# EAGLE design circuit-board (EAGLE 9.2.2)
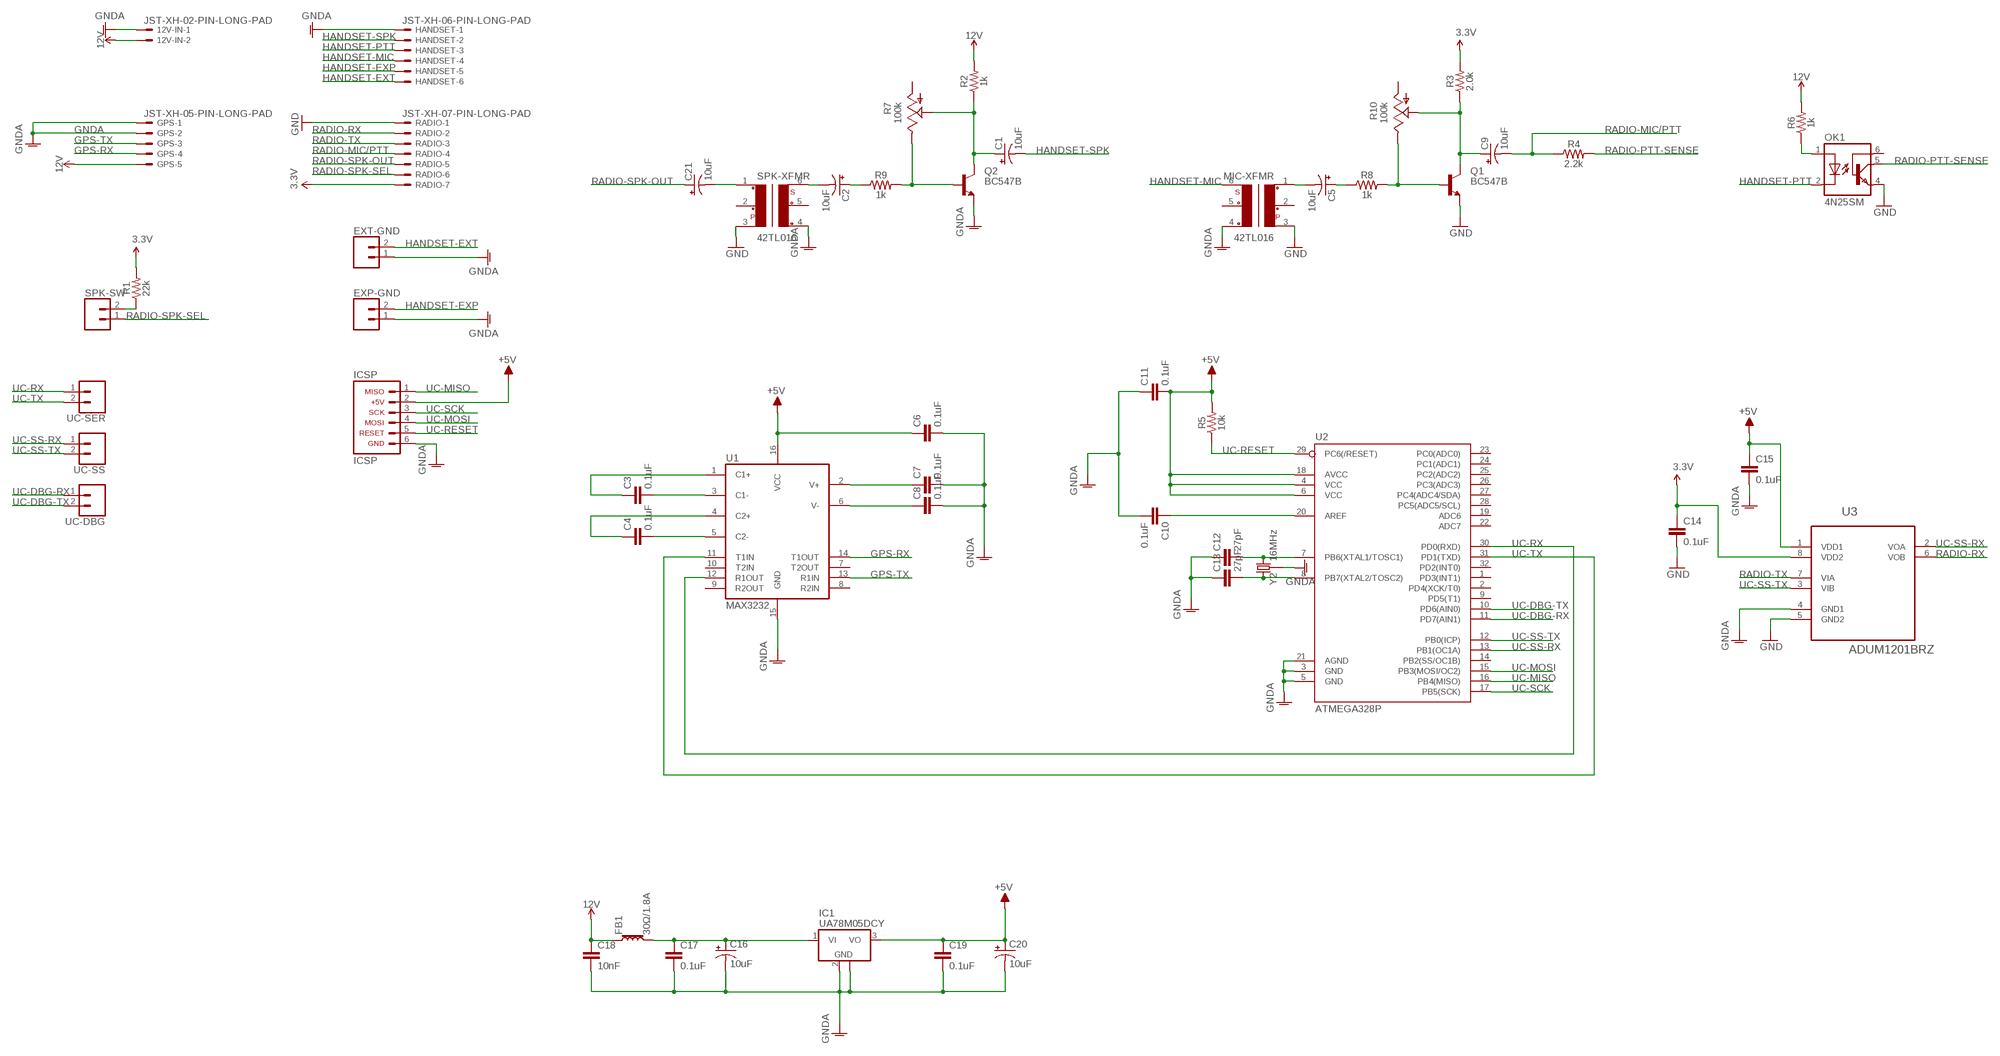
[diagram p0: schematic, sheet 1]

## Parts
12V-IN  JST-XH-02-PIN-LONG-PAD  [JST-XH-02-PACKAGE-LONG-PAD]
C1  10uF  CPOL-USE2.5-5  [E2,5-5]
C2  10uF  CPOL-USE2.5-5  [E2,5-5]
C3  0.1uF  0.1UF-0603-25V-5%  [0603]
C4  0.1uF  0.1UF-0603-25V-5%  [0603]
C5  10uF  CPOL-USE2.5-5  [E2,5-5]
C6  0.1uF  0.1UF-0603-25V-5%  [0603]
C7  0.1uF  0.1UF-0603-25V-5%  [0603]
C8  0.1uF  0.1UF-0603-25V-5%  [0603]
C9  10uF  CPOL-USE2.5-5  [E2,5-5]
C10  0.1uF  0.1UF-0603-25V-5%  [0603]
C11  0.1uF  0.1UF-0603-25V-5%  [0603]
C12  27pF  27PF-0603-50V-5%  [0603]
C13  27pF  27PF-0603-50V-5%  [0603]
C14  0.1uF  0.1UF-0603-25V-5%  [0603]
C15  0.1uF  0.1UF-0603-25V-5%  [0603]
C16  10uF  CPOL-USE2.5-5  [E2,5-5]
C17  0.1uF  0.1UF-0603-25V-5%  [0603]
C18  10nF  10NF-0603-50V-10%  [0603]
C19  0.1uF  0.1UF-0603-25V-5%  [0603]
C20  10uF  CPOL-USE2.5-5  [E2,5-5]
C21  10uF  CPOL-USE2.5-5  [E2,5-5]
EXP-GND  CONN_02  [1X02]
EXT-GND  CONN_02  [1X02]
FB1  30Ω/1.8A  FERRITE_BEAD-0603  [0603]
GPS  JST-XH-05-PIN-LONG-PAD  [JST-XH-05-PACKAGE-LONG-PAD]
HANDSET  JST-XH-06-PIN-LONG-PAD  [JST-XH-06-PACKAGE-LONG-PAD]
IC1  UA78M05DCY  [SOT223]
ICSP  ARDUINO_CONN-ICSP  [CONN-2X03]
MIC-XFMR  42TL016  [42TL]
OK1  4N25SM  [DIL6-SMD]
Q1  BC547B  [TO92]
Q2  BC547B  [TO92]
R1  22k  22KOHM-0603-1/10W-1%  [0603]
R2  1k  1KOHM-0603-1/10W-1%  [0603]
R3  2.0k  2.0KOHM-0603-1/10W-5%  [0603]
R4  2.2k  2.2KOHM-0603-1/10W-1%  [0603]
R5  10k  10KOHM-0603-1/10W-1%  [0603]
R6  1k  1KOHM-0603-1/10W-1%  [0603]
R7  100k  TRIM_US-S64W  [S64W]
R8  1k  1KOHM-0603-1/10W-1%  [0603]
R9  1k  1KOHM-0603-1/10W-1%  [0603]
R10  100k  TRIM_US-S64W  [S64W]
RADIO  JST-XH-07-PIN-LONG-PAD  [JST-XH-07-PACKAGE-LONG-PAD]
SPK-SW  CONN_02  [1X02]
SPK-XFMR  42TL016  [42TL]
U1  MAX3232  MAX2323SOIC16  [SO16]
U2  ATMEGA328P  ATMEGA328P_TQFP  [TQFP32-08]
U3  ADUM1201BRZ  [SOIC127P600X175-8N]
UC-DBG  CONN_02  [1X02]
UC-SER  CONN_02  [1X02]
UC-SS  CONN_02  [1X02]
Y2  16MHz  CRYSTAL-GROUNDEDSMD-3.2X2.5  [CRYSTAL-SMD-3.2X2.5MM]

## Nets
3.3V: C14.1 R1.2 R3.2 RADIO.7 U3.8(VDD2)
12V: 12V-IN.2 C18.1 FB1.1 GPS.5 R2.2 R6.2
+5V: C6.1 C11.2 C15.1 C19.1 C20.+ IC1.3(VO) ICSP.2 R5.2 U1.16(VCC) U2.4(VCC) U2.6(VCC) U2.18(AVCC) U3.1(VDD1)
GND: C14.2 MIC-XFMR.3 OK1.4(EMI) Q1.1(E) RADIO.1 SPK-XFMR.3 U3.5(GND2)
GNDA: 12V-IN.1 C6.2 C7.2 C8.2 C10.2 C11.1 C12.1 C13.1 C15.2 C16.- C17.2 C18.2 C19.2 C20.- EXP-GND.1 EXT-GND.1 GPS.1 GPS.2 HANDSET.1 IC1.2(GND) IC1.4(GND) ICSP.6 MIC-XFMR.4 Q2.1(E) SPK-XFMR.4 U1.15(GND) U2.3(GND) U2.5(GND) U2.21(AGND) U3.4(GND1) Y2.2 Y2.4
GPS-RX: GPS.4 U1.14(T1OUT)
GPS-TX: GPS.3 U1.13(R1IN)
HANDSET-EXP: EXP-GND.2 HANDSET.5
HANDSET-EXT: EXT-GND.2 HANDSET.6
HANDSET-MIC: HANDSET.4 MIC-XFMR.6
HANDSET-PTT: HANDSET.3 OK1.2(C)
HANDSET-SPK: C1.- HANDSET.2
N$1: C16.+ C17.1 FB1.2 IC1.1(VI)
N$2: C2.- SPK-XFMR.6
N$3: C9.+ Q1.3(C) R3.1 R10.S
N$4: Q1.2(B) R8.2 R10.E
N$5: Q2.2(B) R7.E R9.2
N$6: C21.- SPK-XFMR.1
N$7: C5.- MIC-XFMR.1
N$8: C5.+ R8.1
N$9: OK1.1(A) R6.1
N$10: C2.+ R9.1
N$12: R1.1 SPK-SW.2
N$15: C3.2 U1.3(C1-)
N$16: C3.1 U1.1(C1+)
N$17: C4.2 U1.5(C2-)
N$18: C4.1 U1.4(C2+)
N$20: C7.1 U1.2(V+)
N$21: C8.1 U1.6(V-)
N$22: C10.1 U2.20(AREF)
N$23: C12.2 U2.7(PB6(XTAL1/TOSC1)) Y2.3
N$24: C13.2 U2.8(PB7(XTAL2/TOSC2)) Y2.1
RADIO-MIC/PTT: C9.- R4.1 RADIO.4
RADIO-PTT-SENSE: OK1.5(COL) R4.2
RADIO-RX: RADIO.2 U3.6(VOB)
RADIO-SPK-OUT: C21.+ RADIO.5
RADIO-SPK-SEL: RADIO.6 SPK-SW.1
RADIO-TX: RADIO.3 U3.7(VIA)
SPKAMP: C1.+ Q2.3(C) R2.1 R7.S
UC-DBG-RX: U2.11(PD7(AIN1)) UC-DBG.1
UC-DBG-TX: U2.10(PD6(AIN0)) UC-DBG.2
UC-MISO: ICSP.1 U2.16(PB4(MISO))
UC-MOSI: ICSP.4 U2.15(PB3(MOSI/OC2))
UC-RESET: ICSP.5 R5.1 U2.29(PC6(/RESET))
UC-RX: U1.12(R1OUT) U2.30(PD0(RXD)) UC-SER.1
UC-SCK: ICSP.3 U2.17(PB5(SCK))
UC-SS-RX: U2.13(PB1(OC1A)) U3.2(VOA) UC-SS.1
UC-SS-TX: U2.12(PB0(ICP)) U3.3(VIB) UC-SS.2
UC-TX: U1.11(T1IN) U2.31(PD1(TXD)) UC-SER.2
Unconnected: MIC-XFMR.2 MIC-XFMR.5 OK1.6(BAS) R7.A R10.A SPK-XFMR.2 SPK-XFMR.5 U1.7(T2OUT) U1.8(R2IN) U1.9(R2OUT) U1.10(T2IN) U2.1(PD3(INT1)) U2.2(PD4(XCK/T0)) U2.9(PD5(T1)) U2.14(PB2(SS/OC1B)) U2.19(ADC6) U2.22(ADC7) U2.23(PC0(ADC0)) U2.24(PC1(ADC1)) U2.25(PC2(ADC2)) U2.26(PC3(ADC3)) U2.27(PC4(ADC4/SDA)) U2.28(PC5(ADC5/SCL)) U2.32(PD2(INT0))

## Library data of the parts
12V-IN = Rembrandt Electronics - JST XH Connectors v1-0:JST-XH-02-PIN: JST XH Connector 2 Pin Wire to board connector. Pitch: 2,54 mm, (0.100") Number of pins: 2 Created by Rembrandt Electronics www.rembrandtelectronics.com
C1 C2 C5 C9 C16 C20 C21 = adafruit:CPOL-US: POLARIZED CAPACITOR, American symbol
C3 C4 C6-C8 C10 C11 C14 C15 C17 C19 = SparkFun-Capacitors:0.1UF: 0.1µF ceramic capacitors A capacitor is a passive two-terminal electrical component used to store electrical energy temporarily in an electric field.; PROD_ID: CAP-08604
C12 C13 = SparkFun-Capacitors:27PF: 27pF ceramic capacitors A capacitor is a passive two-terminal electrical component used to store electrical energy temporarily in an electric field.; PROD_ID: CAP-09989
C18 = SparkFun-Capacitors:10NF: 0.01uF/10nF/10,000pF ceramic capacitors A capacitor is a passive two-terminal electrical component used to store electrical energy temporarily in an electric field. CAP-09321; PROD_ID: CAP-00867
EXP-GND EXT-GND SPK-SW UC-DBG UC-SER UC-SS = SparkFun-Connectors:CONN_02: Multi connection point. Often used as Generic Header-pin footprint for 0.1 inch spaced/style header connections On any of the 0.1 inch spaced packages, you can populate with these: Break Away Headers - Straight <https://www.sparkfun.com/products/116> (PRT-00116) Break Away Male Headers - Right Angle <https://www.sparkfun.com/products/553> (PRT-00553) Female Headers <https://www.sparkfun.com/products/115> (PRT-00115) Break Away Headers - Machine Pin <https://www.sparkfun.com/products/117> (PRT-00117) Break Away Female Headers - Swiss Machine Pin <https://www.sparkfun.com/products/743> (PRT-00743) For SCREWTERMINALS and SPRING TERMINALS visit here: Screw Terimnals on SparkFun.com <https://www.sparkfun.com/search/results?term=Screw+Terminals> (5mm/3.5mm/2.54mm spacing) This device is also useful as a general connection point to wire up your design to another part of your project. Our various solder wires solder well into these plated through hole pads. Hook-Up Wire - Assortment (Stranded, 22 AWG) <https://www.sparkfun.com/products/11375> (PRT-11375) Hook-Up Wire - Assortment (Solid Core, 22 AWG) <https://www.sparkfun.com/products/11367> (PRT-11367) View the entire wire category on our website here <https://www.sparkfun.com/categories/141> Special notes: Molex polarized connector foot print use with: PRT-08233 with associated crimp pins and housings. 2.54_SCREWTERM for use with PRT-10571. 3.5mm Screw Terminal footprints for PRT-08084 5mm Screw Terminal footprints for use with PRT-08432
FB1 = SparkFun-Coils:FERRITE_BEAD: Ferrite Bead (blocks, cores, rings, chokes, etc.) Inductor with layers of ferrite used to suppress high frequencies. Often used to isolate high frequency noise. SparkFun Products: IOIO-OTG - V2.2 <https://www.sparkfun.com/products/13613> SparkFun SAMD21 Mini Breakout <https://www.sparkfun.com/products/13664> SparkFun 6 Degrees of Freedom Breakout - LSM6DS3 <https://www.sparkfun.com/products/13339> SparkFun SAMD21 Dev Breakout <https://www.sparkfun.com/products/13672>; PROD_ID: NDUC-07859
GPS = Rembrandt Electronics - JST XH Connectors v1-0:JST-XH-05-PIN: JST XH Connector 2 Pin Wire to board connector. Pitch: 2,54 mm, (0.100") Number of pins: 5 Created by Rembrandt Electronics www.rembrandtelectronics.com
HANDSET = Rembrandt Electronics - JST XH Connectors v1-0:JST-XH-06-PIN: JST XH Connector 2 Pin Wire to board connector. Pitch: 2,54 mm, (0.100") Number of pins: 6 Created by Rembrandt Electronics www.rembrandtelectronics.com
IC1 = linear:UA78M*: POSITIVE-VOLTAGE REGULATORS Source: http://focus.ti.com/lit/ds/symlink/ua78m33.pdf
ICSP = arduino_jw:ARDUINO_CONN-ICSP: Arduino ICSP I/O Header This is the ICSP I/O header on the Arduino Uno R3. This connector is labeled with the following pin assignments: MISO +5V SCK MOSI RESET GND NOTE: Be sure you install this connector with the correct orientation on your PCB layout. Pin 1 has a square pad to assist with orientation.
MIC-XFMR SPK-XFMR = trafo-xicon:42T?*: Xicon Micro-Mini EI-12 Audio Transformers 42TL/42TC/42TM Series Source: http://www.mouser.com//catalog/specsheets/164201.pdf http://www.mouser.com/catalog/specsheets/114225.pdf http://www.mouser.com/catalog/specsheets/164267.pdf; OC_FARNELL: unknown; OC_NEWARK: unknown
OK1 = optocoupler:4N*?M: General Purpose 6-Pin Phototransistor Optocouplers Source: http://www.fairchildsemi.com/ds/4N/4N35-M.pdf; MF: FAIRCHILD SEMICONDUCTOR; MPN: 4N25SM; OC_FARNELL: 1021152; OC_NEWARK: 34C2020
Q1 Q2 = transistor-npn:BC547*: NPN Transistor
R1 = SparkFun-Resistors:22KOHM: 22kΩ resistor A resistor is a passive two-terminal electrical component that implements electrical resistance as a circuit element. Resistors act to reduce current flow, and, at the same time, act to lower voltage levels within circuits. - Wikipedia; PROD_ID: RES-07853
R2 R6 R8 R9 = SparkFun-Resistors:1KOHM: 1kΩ resistor A resistor is a passive two-terminal electrical component that implements electrical resistance as a circuit element. Resistors act to reduce current flow, and, at the same time, act to lower voltage levels within circuits. - Wikipedia; PROD_ID: RES-07856
R3 = SparkFun-Resistors:2.0KOHM: 2kΩ resistor A resistor is a passive two-terminal electrical component that implements electrical resistance as a circuit element. Resistors act to reduce current flow, and, at the same time, act to lower voltage levels within circuits. - Wikipedia; PROD_ID: RES-08296
R4 = SparkFun-Resistors:2.2KOHM: 2.2kΩ resistor A resistor is a passive two-terminal electrical component that implements electrical resistance as a circuit element. Resistors act to reduce current flow, and, at the same time, act to lower voltage levels within circuits. - Wikipedia; PROD_ID: RES-08272
R5 = SparkFun-Resistors:10KOHM: 10kΩ resistor A resistor is a passive two-terminal electrical component that implements electrical resistance as a circuit element. Resistors act to reduce current flow, and, at the same time, act to lower voltage levels within circuits. - Wikipedia; PROD_ID: RES-00824
R7 R10 = pot:TRIM_US-: POTENTIOMETER
RADIO = Rembrandt Electronics - JST XH Connectors v1-0:JST-XH-07-PIN: JST XH Connector 2 Pin Wire to board connector. Pitch: 2,54 mm, (0.100") Number of pins: 7 Created by Rembrandt Electronics www.rembrandtelectronics.com
U1 = SparkFun-IC-Comms:MAX2323: RS232 Transceiver This part covers 232 drivers that are compatible with the MAX3232. Sipex SP3232EB Datasheet <http://cdn.sparkfun.com/datasheets/Components/General%20IC/SP3232EBCA-L.pdf> SparkFun Products SOIC component <https://www.sparkfun.com/products/589> (COM-00589 / IC-08171) Retired DIP component (COM-00316 / IC-08446) SparkFun Transceiver Breakout - MAX3232 <https://www.sparkfun.com/products/11189> (BOB-11189) SparkFun XBee Explorer Serial <https://www.sparkfun.com/products/13225> (WRL-13225); PROD_ID: IC-08171
U2 = SparkFun-IC-Microcontroller:ATMEGA328P_TQFP: Popular 328P in QFP Storefront component: ATmega328 - TQFP <https://www.sparkfun.com/products/13448> (COM-13448) Datasheet <http://www.sparkfun.com/datasheets/Components/SMD/ATMega328.pdf> SparkFun Products SparkFun RedBoard - Programmed with Arduino <https://www.sparkfun.com/products/12757> (DEV-12757) Arduino Pro Mini 328 - 5V/16MHz <https://www.sparkfun.com/products/11113> (DEV-11113) Arduino Pro Mini 328 - 3.3V/8MHz <https://www.sparkfun.com/products/11114> (DEV-11114) SparkFun OpenLog <https://www.sparkfun.com/products/13712> (DEV-13712) SparkFun MicroView - OLED Arduino Module <https://www.sparkfun.com/products/12923> (DEV-12923) SparkFun Digital Sandbox <https://www.sparkfun.com/products/12651> (DEV-12651) SparkFun PicoBoard <https://www.sparkfun.com/products/11888> (WIG-11888) Arduino Fio <https://www.sparkfun.com/products/10116> (DEV-10116) LilyPad Arduino 328 Main Board <https://www.sparkfun.com/products/13342> (DEV-13342) SparkFun RedStick <https://www.sparkfun.com/products/13741> (DEV-13741) LilyPad MP3 <https://www.sparkfun.com/products/11013> (DEV-11013) LilyPad Arduino SimpleSnap <https://www.sparkfun.com/products/10941> (DEV-10941) SparkFun Stepoko <https://www.sparkfun.com/products/13899> (ROB-13899) SparkFun Geiger Counter <https://www.sparkfun.com/products/11345> (SEN-11345) SparkFun EL Sequencer <https://www.sparkfun.com/products/12781> (COM-12781) Arduino Pro 328 - 5V/16MHz <https://www.sparkfun.com/products/10915> (DEV-10915) CryptoCape <https://www.sparkfun.com/products/12773> (DEV-12773) SparkFun IR Thermometer Evaluation Board - MLX90614 <https://www.sparkfun.com/products/10740> (SEN-10740) SparkFun RedBot Mainboard <https://www.sparkfun.com/products/12097> (ROB-12097) Arduino Pro 328 - 3.3V/8MHz <https://www.sparkfun.com/products/10914> (DEV-10914) SparkFun Block for Intel® Edison - Arduino <https://www.sparkfun.com/products/13036> (DEV-13036) SparkFun Simon Says - Surface Mount Soldering Kit <https://www.sparkfun.com/products/10935> (KIT-10935) SparkFun 7-Segment Serial Display - Red <https://www.sparkfun.com/products/11441> (COM-11441) SparkFun 7-Segment Serial Display - White <https://www.sparkfun.com/products/11629> (COM-11629) SparkFun 7-Segment Serial Display - Yellow <https://www.sparkfun.com/products/11443> (COM-11443) SparkFun 7-Segment Serial Display - Kelly Green <https://www.sparkfun.com/products/11440> (COM-11440) SparkFun 7-Segment Serial Display - Blue <https://www.sparkfun.com/products/11442> (COM-11442) SparkFun OpenSegment Serial Display - 20mm (Blue) <https://www.sparkfun.com/products/11647> (COM-11647) SparkFun OpenSegment Serial Display - 20mm (Green) <https://www.sparkfun.com/products/11646> (COM-11646) SparkFun OpenSegment Serial Display - 20mm (White) <https://www.sparkfun.com/products/11648> (COM-11648) SparkFun OpenSegment Serial Display - 20mm (Red) <https://www.sparkfun.com/products/11644> (COM-11644) SparkFun OpenSegment Serial Display - 20mm (Yellow) <https://www.sparkfun.com/products/11645> (COM-11645) SparkFun OpenSegment Shield <https://www.sparkfun.com/products/13190> (DEV-13190); PROD_ID: IC-09069; VALUE: ATMEGA328P_TQFP
U3 = Analog Devices_By_element14_Batch_1:ADUM1201BRZ: Dual-Channel Digital Isolators; MPN: ADUM1201BRZ; OC_FARNELL: 1078201; OC_NEWARK: 19M8748; PACKAGE: SOIC-8; SUPPLIER: Analog Devices
Y2 = SparkFun-Clocks:CRYSTAL-GROUNDED: Crystals w/ Ground Pin (Generic) These are passive quartz crystals, which can be used as a clock source for a microcontroller. Crystal's are usually two-terminal devices. A third terminal may be optionally connected to ground, as recommended by the manufaturer.

## Board
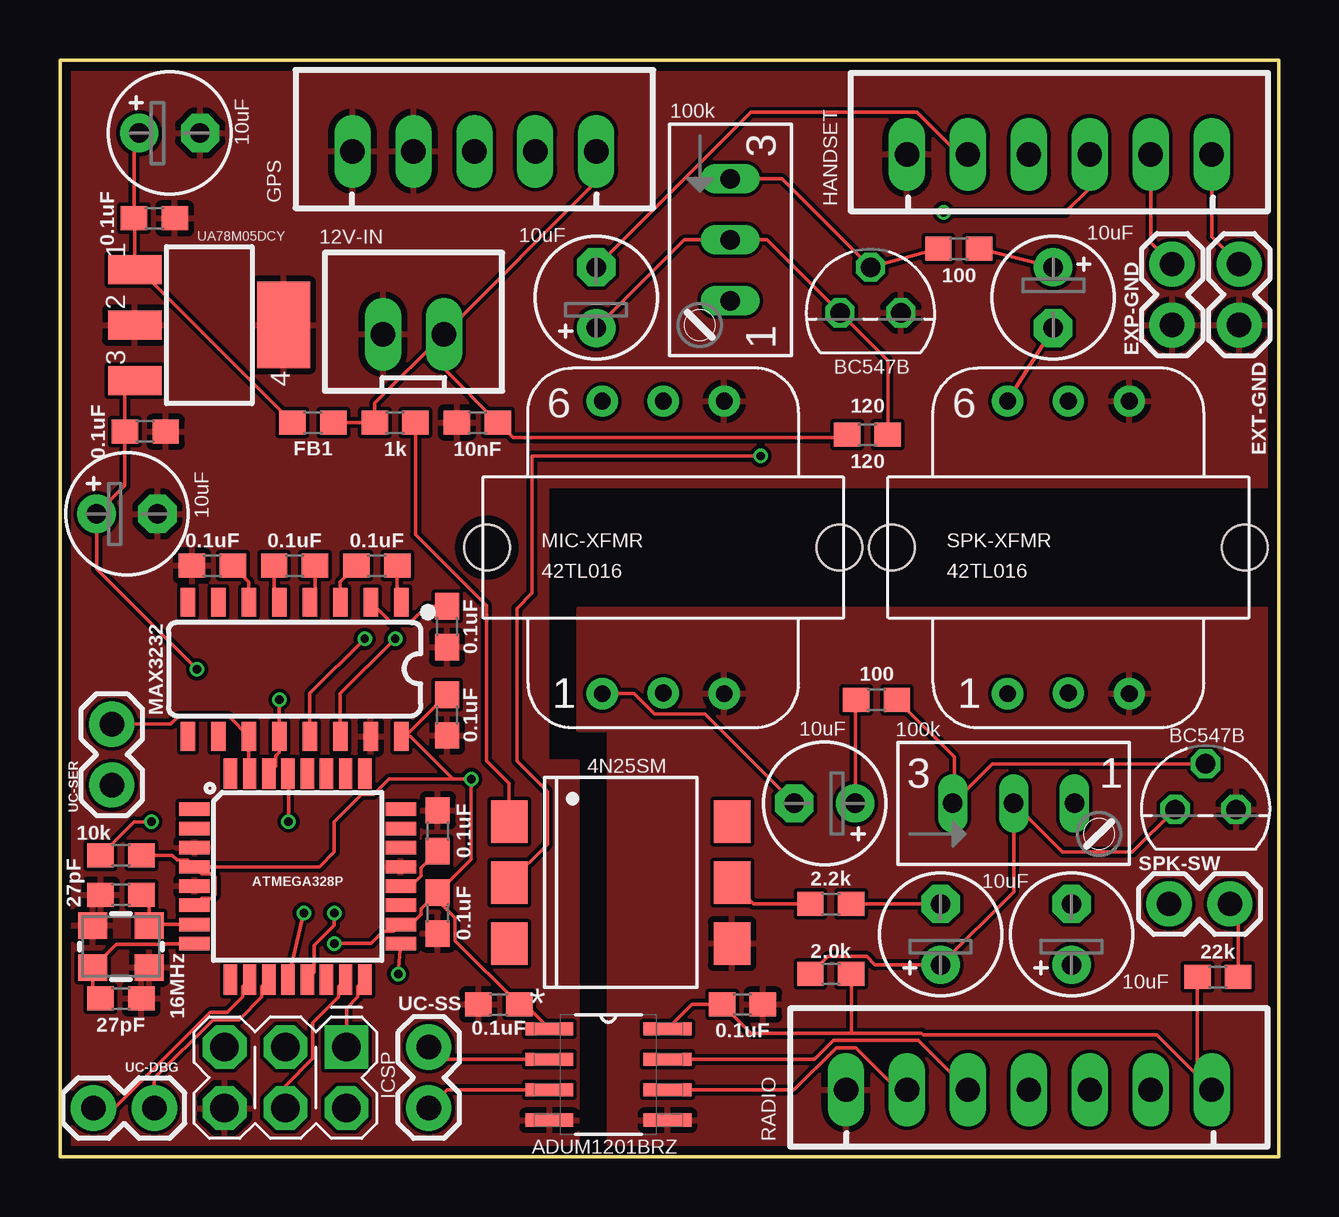
[diagram p1: board, top side]
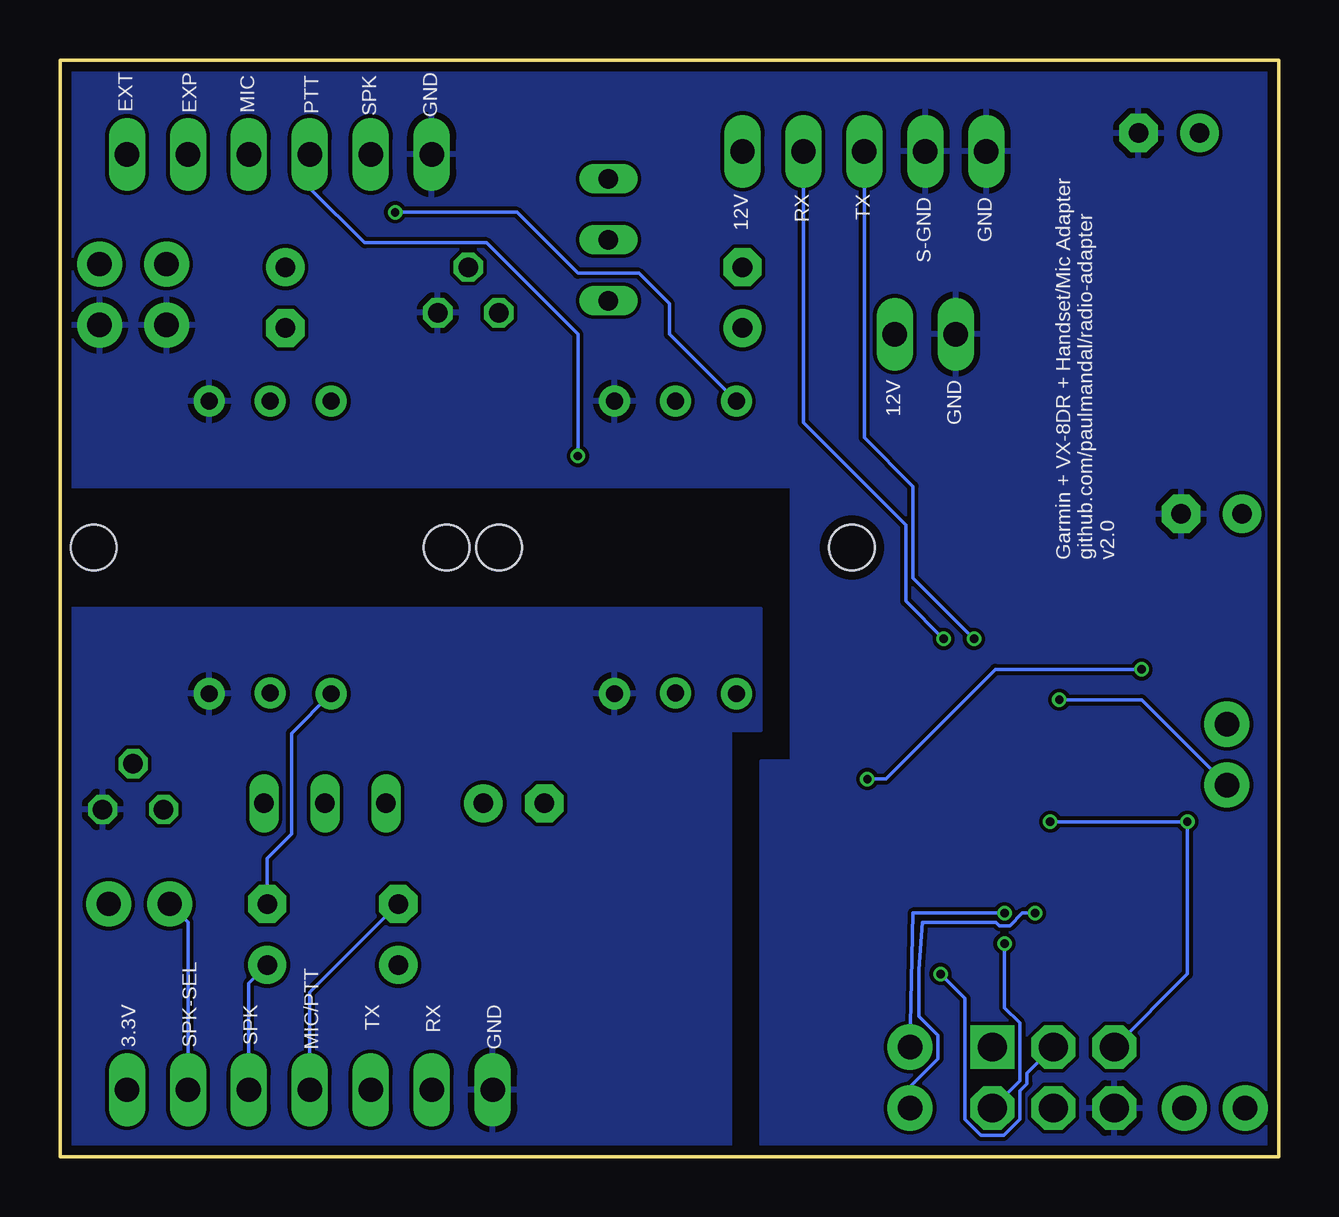
[diagram p2: board, bottom side, seen from below]

Size 50.8 x 45.72 mm. Coordinates in mm from the lower left corner, seen from the top.
Outline: 0,0 50.8,0 50.8,45.72 0,45.72 0,0
Copper layers (1*16): Top 0.035559375mm / dielectric 1.6mm / Bottom 0.035559375mm
Design rules "oshpark-2layer *": minimum track width 6mil, minimum drill 10mil, track to track 6mil, track to pad 6mil, pad to pad 6mil, via to via 6mil, smd to smd 6mil, copper to edge 15mil, drill to drill 6mil, minimum pad ring 5mil, minimum via ring 5mil, stop-mask expansion 2.5mil, vias tented up to drill 20mil, thermal gap 10mil

### Footprints (pad centres in the part's own frame; a part is rotated, then mirrored left to right if it is on the bottom)
JST-XH-02-PACKAGE-LONG-PAD = drill 1.016 long: 1 -1.27,0; 2 1.27,0
E2,5-5 = drill 0.813 pad 1.6: + -1.27,0 | drill 0.813 pad 1.6 octagon: - 1.27,0
0603 = smd 1.1 x 1: 1 -0.85,0; 2 0.85,0
1X02 = drill 1.016 pad 1.88: 1 0,0; 2 2.54,0
JST-XH-05-PACKAGE-LONG-PAD = drill 1.016 long: 1 -5.08,0; 2 -2.54,0; 3 0,0; 4 2.54,0; 5 5.08,0
JST-XH-06-PACKAGE-LONG-PAD = drill 1.016 long: 1 -6.35,0; 2 -3.81,0; 3 -1.27,0; 4 1.27,0; 5 3.81,0; 6 6.35,0
SOT223 = smd 1.219 x 2.235: 1 -2.311,-3.099; 2 0,-3.099; 3 2.311,-3.099 | smd 3.6 x 2.2: 4 0,3.099
CONN-2X03 = drill 1.2 pad 1.829 square: 1 0,0 | drill 1.2 pad 1.829 octagon: 2 2.54,0; 3 0,-2.54; 4 2.54,-2.54; 5 0,-5.08; 6 2.54,-5.08
42TL = drill 0.7 pad 1.3: 1 -2.54,-6.096; 2 0,-6.068; 3 2.54,-6.096; 4 2.54,6.096; 5 0,6.096; 6 -2.54,6.096 | hole 1.9: -7.353,0; 7.353,0
DIL6-SMD = smd 1.78 x 1.52: 1 -2.54,-4.645; 2 0,-4.645; 3 2.54,-4.645; 4 2.54,4.645; 5 0,4.645; 6 -2.54,4.645
TO92 = drill 0.813 octagon: 1 1.27,0; 2 0,1.905; 3 -1.27,0
S64W = drill 0.813 long: A 2.54,1.27; E -2.54,1.27; S 0,1.27
JST-XH-07-PACKAGE-LONG-PAD = drill 1.016 long: 1 -7.62,0; 2 -5.08,0; 3 -2.54,0; 4 0,0; 5 2.54,0; 6 5.08,0; 7 7.62,0
SO16 = smd 0.6 x 1.2: 1 -4.445,-2.8; 2 -3.175,-2.8; 3 -1.905,-2.8; 4 -0.635,-2.8; 5 0.635,-2.8; 6 1.905,-2.8; 7 3.175,-2.8; 8 4.445,-2.8; 9 4.445,2.8; 10 3.175,2.8; 11 1.905,2.8; 12 0.635,2.8; 13 -0.635,2.8; 14 -1.905,2.8; 15 -3.175,2.8; 16 -4.445,2.8
TQFP32-08 = smd 1.27 x 0.559: 1 -4.293,2.8; 2 -4.293,2; 3 -4.293,1.2; 4 -4.293,0.4; 5 -4.293,-0.4; 6 -4.293,-1.2; 7 -4.293,-2; 8 -4.293,-2.8; 17 4.293,-2.8; 18 4.293,-2; 19 4.293,-1.2; 20 4.293,-0.4; 21 4.293,0.4; 22 4.293,1.2; 23 4.293,2; 24 4.293,2.8 | smd 0.559 x 1.27: 9 -2.8,-4.293; 10 -2,-4.293; 11 -1.2,-4.293; 12 -0.4,-4.293; 13 0.4,-4.293; 14 1.2,-4.293; 15 2,-4.293; 16 2.8,-4.293; 25 2.8,4.293; 26 2,4.293; 27 1.2,4.293; 28 0.4,4.293; 29 -0.4,4.293; 30 -1.2,4.293; 31 -2,4.293; 32 -2.8,4.293
SOIC127P600X175-8N = smd 1.981 x 0.559: 1 -2.464,1.905; 2 -2.464,0.635; 3 -2.464,-0.635; 4 -2.464,-1.905; 5 2.464,-1.905; 6 2.464,-0.635; 7 2.464,0.635; 8 2.464,1.905
CRYSTAL-SMD-3.2X2.5MM = smd 1.2 x 1.1: 1 -1.175,-0.875; 2 1.175,-0.875; 3 1.175,0.875; 4 -1.175,0.875

### Placement (x,y rotation side)
12V-IN  14.73,34.29 0 top
C1  22.35,35.81 90 top
C2  41.4,35.81 270 top
C3  13.21,24.64 180 top
C4  9.78,24.64 180 top
C5  31.88,14.73 180 top
C6  16.13,18.41 270 top
C7  16.13,22.1 270 top
C8  6.35,24.64 180 top
C9  36.7,9.27 90 top
C10  15.75,13.59 90 top
C11  15.75,10.16 90 top
C12  2.54,10.92 0 top
C13  2.54,6.6 180 top
C14  28.45,6.35 0 top
C15  18.29,6.35 180 top
C16  4.57,42.67 0 top
C17  3.94,39.12 0 top
C18  17.4,30.61 180 top
C19  3.56,30.23 0 top
C20  2.79,26.8 0 top
C21  42.16,9.27 90 top
EXP-GND  46.35,34.67 90 top
EXT-GND  49.15,34.67 90 top
FB1  10.54,30.61 180 top
GPS  17.27,41.91 0 top
HANDSET  41.66,41.78 0 top
IC1  6.22,34.67 270 top
ICSP  11.94,4.57 270 top
MIC-XFMR  25.15,25.4 0 top
OK1  23.37,11.43 270 top
Q1  47.75,14.48 0 top
Q2  33.78,35.18 0 top
R1  48.26,7.49 180 top
R2  120  [0603]  33.66,30.1 180 top
R3  32.13,7.62 0 top
R4  32.13,10.54 180 top
R5  2.54,12.57 0 top
R6  13.97,30.61 180 top
R7  26.67,38.23 270 top
R8  100  [0603]  34.04,19.05 0 top
R9  100  [0603]  37.47,37.85 180 top
R10  39.75,13.46 0 top
RADIO  40.39,2.79 0 top
SPK-SW  46.23,10.54 0 top
SPK-XFMR  42.04,25.4 0 top
U1  9.78,20.32 180 top
U2  9.91,11.68 0 top
U3  22.86,3.43 0 top
UC-DBG  3.94,2.03 180 top
UC-SER  2.16,15.49 90 top
UC-SS  15.37,4.57 270 top
Y2  2.54,8.76 0 top

### Tracks (layer width: path | path; a pad name or v marks a point on that pad's centre or on a via)
3.3V
  Top 0.152: U3.8 26.34,6.35 C14.1 28.79,5.16 33.02,5.16 | 33.02,5.16 35.91,5.16 35.99,5.08 45.72,5.08 RADIO.7 47.41,3.39 R1.2 | R3.2 32.98,5.2 33.02,5.16
12V
  Top 0.152: 12V-IN.2 16,32.85 C18.1 18.88,29.97 32.68,29.97 R2.2 | 12V-IN.2 22.35,40.64 GPS.5 | 16,33.49 12V-IN.2 | 12V-IN.2 13.12,31.41 R6.2 FB1.1
+5V  (via drill 0.35)
  Top 0.152: IC1.3 2.71,31.94 C19.1 2.71,27.98 C20.+ 1.52,24.51 v5.71,20.32 | C6.1 14.38,17.52 U1.16 14.61,17.52 16.38,15.75 v17.14,15.75 | U3.1 19.38,6.35 C15.1 16.48,9.01 16.48,9.96 15.75,10.68 C11.2 | C11.2 17.14,12.41 v17.14,15.75 | U2.4 5.32,12.38 4.88,12.38 4.69,12.57 R5.2 | C11.2 15.06,10.32 15.06,10.11 14.64,9.68 U2.18 13.91,9.39 13.47,9.39 12.97,8.89 v11.43,8.89 | v17.14,15.75 13.71,15.75 13.08,15.11 12.57,15.11 11.43,13.97 11.43,12.7 10.81,12.08 U2.4 | U2.4 5.91,11.79 6.34,11.79 6.48,11.66 6.48,10.91 6.34,10.78 5.91,10.78 U2.6
  Bottom 0.152: v17.14,15.75 16.38,15.75 11.81,20.32 v5.71,20.32 | v11.43,8.89 11.43,6.22 10.79,5.58 10.79,3.17 ICSP.2
GND
  pour Top: 22.86,0 22.86,17.78 21.59,17.78 21.59,22.86 50.8,22.86 50.8,0
  pour Bottom: 22.86,0 22.86,17.78 21.59,17.78 21.59,20.32 21.59,22.86 50.8,22.86 50.8,0
GNDA
  pour Top: 21.59,0 0,0 0,45.72 50.8,45.72 50.8,27.94 20.32,27.94 20.32,16.51 21.59,16.51
  pour Bottom: 21.59,0 21.59,16.51 20.32,16.51 20.32,27.94 50.8,27.94 50.8,45.72 0,45.72 0,0
GPS-RX  (via drill 0.35)
  Top 0.152: v13.97,21.59 11.68,19.3 U1.14
  Bottom 0.152: v13.97,21.59 15.54,23.16 15.54,26.34 19.81,30.61 GPS.4
GPS-TX  (via drill 0.35)
  Top 0.152: v12.7,21.59 10.41,19.3 U1.13
  Bottom 0.152: v12.7,21.59 15.24,24.13 15.24,27.94 17.27,29.97 GPS.3
HANDSET-EXP
  Top 0.152: HANDSET.5 45.47,38.1 EXP-GND.2
HANDSET-EXT
  Top 0.152: HANDSET.6 48.01,38.35 EXT-GND.2
HANDSET-MIC  (via drill 0.35)
  Top 0.152: v36.83,39.37 41.91,39.37 42.93,40.39 HANDSET.4
  Bottom 0.152: MIC-XFMR.6 25.4,34.29 25.4,35.56 26.67,36.83 29.21,36.83 31.75,39.37 v36.83,39.37
HANDSET-PTT  (via drill 0.35)
  Top 0.152: OK1.2 20.32,13.03 20.32,15.24 19.05,16.51 19.05,22.86 19.68,23.5 19.68,29.21 v29.21,29.21
  Bottom 0.152: v29.21,29.21 29.21,34.29 33.02,38.1 38.1,38.1 40.39,40.39 HANDSET.3
HANDSET-SPK
  Top 0.152: HANDSET.2 37.47,41.78 35.72,43.54 28.8,43.54 C1.-
N$1
  Top 0.152: C17.1 3.12,39.08 IC1.1 3.32,36.98 FB1.2 | C17.1 3.05,39.16 | C17.1 3.09,42.46 C16.+
N$2
  Top 0.152: SPK-XFMR.6 C2.-
N$3
  Top 0.152: R3.1 32.01,8.35 33.63,8.35 33.97,8 C9.+ 39.75,11.05 R10.S 41.78,12.7 44.7,12.7 Q1.3
N$4
  Top 0.152: Q1.2 38.86,16.38 37.27,14.8 | 37.27,14.8 R10.E | R8.2 37.27,16.66 37.27,14.8
N$5
  Top 0.152: R7.E 30.1,40.77 Q2.2 R9.2
N$6
  Bottom 0.152: C21.- 42.16,12.45 41.15,13.46 41.15,17.65 SPK-XFMR.1
N$7
  Top 0.152: MIC-XFMR.1 23.93,19.3 24.78,18.45 26.89,18.45 C5.-
N$8
  Top 0.152: C5.+ 33.15,19.01 R8.1
N$9
  Top 0.152: OK1.1 18.72,15.57 17.78,16.51 17.78,22.99 14.82,25.95 R6.1
N$10
  Top 0.152: R9.1 C2.+
N$12
  Top 0.152: R1.1 49.11,10.2 SPK-SW.2
N$15
  Top 0.152: C3.2 11.68,23.96 U1.3
N$16
  Top 0.152: C3.1 14.06,23.29 U1.1
N$17
  Top 0.152: C4.2 8.93,23.34 U1.5
N$18
  Top 0.152: C4.1 10.63,23.34 U1.4
N$20
  Top 0.152: C7.1 15.28,22.95 14.62,22.29 13.78,22.29 U1.2
N$21
  Top 0.152: C8.1 7.87,23.96 U1.6
N$22
  Top 0.152: C10.1 15.06,12.05 15.06,11.71 14.64,11.28 U2.20
N$23
  Top 0.152: C12.2 3.71,10.6 Y2.3 3.76,9.68 U2.7
N$24
  Top 0.152: U2.8 4.43,8.88 4.41,8.86 2.34,8.86 Y2.1 1.36,6.93 C13.2
RADIO-MIC/PTT
  Top 0.152: R4.1 C9.-
  Bottom 0.152: RADIO.4 40.39,6.86 C9.-
RADIO-PTT-SENSE
  Top 0.152: OK1.5 28.9,10.54 R4.2
RADIO-RX
  Top 0.152: U3.6 30.6,2.79 32.36,4.55 33.18,4.55 34.93,2.79 RADIO.2
RADIO-SPK-OUT
  Bottom 0.152: RADIO.5 42.93,7.24 C21.+
RADIO-SPK-SEL
  Bottom 0.152: RADIO.6 45.47,9.78 SPK-SW.1
RADIO-TX
  Top 0.152: U3.7 31.44,4.06 32.23,4.85 35.79,4.85 RADIO.3
SPKAMP
  Top 0.152: R2.1 34.51,33.19 Q2.3 29.46,38.23 R7.S 26.04,38.23 C1.+
UC-DBG-RX
  Top 0.152: U2.11 8.41,7.1 8.41,6.66 7.47,5.71 6.38,5.71 3.94,3.27 UC-DBG.1
UC-DBG-TX
  Top 0.152: U2.10 7.61,7.1 7.61,6.66 6.97,6.02 6.26,6.02 2.27,2.03 UC-DBG.2
UC-MISO
  Top 0.152: U2.16 12.41,7.1 12.41,6.66 11.94,6.19 ICSP.1
UC-MOSI
  Top 0.152: U2.15 11.61,7.1 11.61,6.66 10.54,5.59 10.54,4.1 9.4,2.96 ICSP.4
UC-RESET  (via drill 0.35)
  Top 0.152: R5.1 3.09,13.97 v3.81,13.97 | v9.53,13.97 9.53,15.96 U2.29
  Bottom 0.152: v9.53,13.97 v3.81,13.97 3.81,7.62 ICSP.5
UC-RX  (via drill 0.35)
  Top 0.152: U2.30 9,16.27 9,16.71 9.14,16.85 U1.12 v9.14,19.05
  Bottom 0.152: v9.14,19.05 5.71,19.05 UC-SER.1
UC-SCK  (via drill 0.35)
  Top 0.152: U2.17 v14.1,7.62
  Bottom 0.152: v14.1,7.62 13.08,6.6 13.08,1.56 12.41,0.89 11.46,0.89 10.79,1.56 10.79,2.74 10.49,3.05 10.49,3.48 ICSP.3
UC-SS-RX  (via drill 0.35)
  Top 0.152: U3.2 15.88,4.06 UC-SS.1 | U2.13 10.6,7.68 10.6,8.81 11.43,9.64 v11.43,10.16
  Bottom 0.152: UC-SS.1 15.24,10.16 v11.43,10.16
UC-SS-TX  (via drill 0.35)
  Top 0.152: U3.3 16.13,2.79 UC-SS.2 | U2.12 v10.16,10.16
  Bottom 0.152: v10.16,10.16 10.68,10.16 11.21,9.63 11.65,9.63 11.8,9.78 14.86,9.78 14.99,7.8 14.99,5.85 14.2,5.06 14.2,4.09 15.37,2.92 UC-SS.2
UC-TX
  Top 0.152: U2.31 7.87,16.01 U1.11 7.04,18.35 4.94,18.35 4.62,18.03 UC-SER.2

### Text on the board
bPlace: GND | SPK | PTT | MIC | EXP | EXT | GND | S-GND | TX | RX | 12V | GND | 12V | Garmin + VX-8DR + Handset/Mic Adapter / github.com/paulmandal/radio-adapter / v2.0 | MIC/PTT | SPK-SEL | GND | RX | TX | SPK | 3.3V
tNames: 120